# Altium schematic sheet LightSensor.SchDoc: Nitrogen Generic Sensor
size A4; Author: Michael Kapuscik; Engineer: Michael Kapuscik; SheetNumber: 1
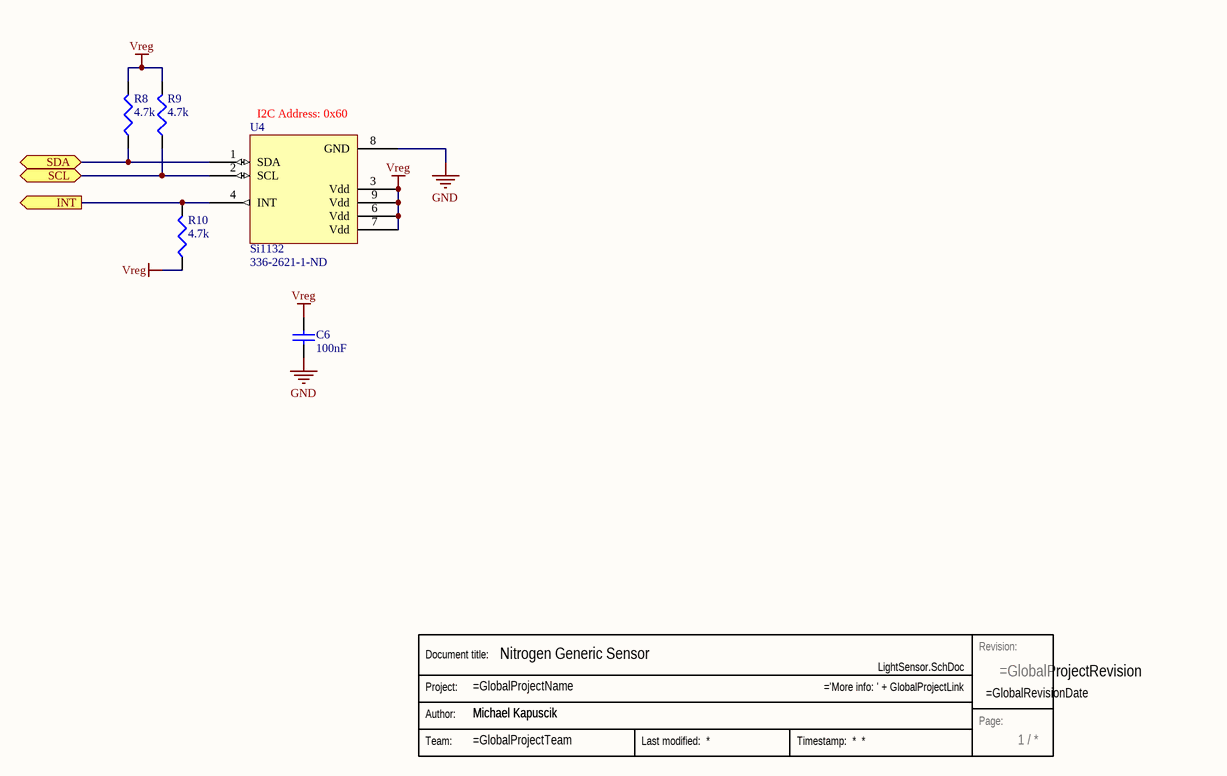
[diagram p0: LightSensor.SchDoc]

## Parts
C6  value 100nF  [1608[0603]]  (hidden comment: Cap)
R8  value 4.7k  [J1-0603]  (hidden comment: Res3)
R9  value 4.7k  [J1-0603]  (hidden comment: Res3)
R10  value 4.7k  [J1-0603]  (hidden comment: Res3)
Stamp  Stamp  (value not drawn)  (graphical)
U4  Si1132  Supplier Part Number 1: 336-2621-1-ND  [QFN10 2x2 Si1132]

## Ports
INT (out), SCL (bidir), SDA (bidir)

## Nets
GND: C6.1 U4.8(GND)
Vreg: C6.2 R8.2 R9.2 R10.1 U4.3(Vdd) U4.6(Vdd) U4.7(Vdd) U4.9(Vdd)
INT: R10.2 U4.4(INT) ; port INT
SCL: R9.1 U4.2(SCL) ; port SCL
SDA: R8.1 U4.1(SDA) ; port SDA

## Notes on the sheet
- (near U4) I2C Address: 0x60
- (in symbol Stamp) Revision:; Document title:; Project:; Author:; Page:; Team:

## Library data of the parts
C6 = Cap Semi: Capacitor (Semiconductor SIM Model); Published: 8-Jun-2000; LatestRevisionDate: 29-May-2009; LatestRevisionNote: IPC-7351 Footprint Added.; PackageReference: C1206; Publisher: Altium Limited; PackageDescription: Chip Capacitor
R8-R10 = Res3: Resistor; Published: 8-Jun-2000; LatestRevisionDate: 29-May-2009; LatestRevisionNote: IPC-7351 Footprint Added.; PackageReference: J1-0603; Publisher: Altium Limited; PackageDescription: Chip Resistor
U4 = Si1132: Supplier 1: Digi-Key